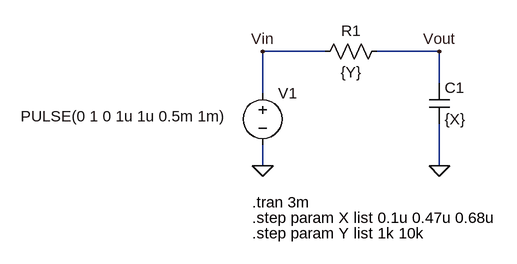
[diagram p0: schematic Parameter_Sweeps_RC_Response.asc]
Parameter_Sweeps_RC_Response.asc, the LTspice schematic file:
Version 4
SHEET 1 880 680
WIRE 144 128 48 128
WIRE 320 128 224 128
WIRE 320 176 320 128
WIRE 48 192 48 128
WIRE 48 304 48 272
WIRE 320 304 320 240
FLAG 48 304 0
FLAG 320 304 0
FLAG 48 128 Vin
FLAG 320 128 Vout
SYMBOL res 240 112 R90
WINDOW 0 0 56 VBottom 2
WINDOW 3 32 56 VTop 2
SYMATTR InstName R1
SYMATTR Value {Y}
SYMBOL voltage 48 176 R0
WINDOW 3 -372 52 Left 2
WINDOW 123 0 0 Left 0
WINDOW 39 0 0 Left 0
SYMATTR InstName V1
SYMATTR Value PULSE(0 1 0 1u 1u 0.5m 1m)
SYMBOL cap 304 176 R0
SYMATTR InstName C1
SYMATTR Value {X}
TEXT 32 360 Left 2 !.tran 3m
TEXT 32 384 Left 2 !.step param X list 0.1u 0.47u 0.68u
TEXT 32 408 Left 2 !.step param Y list 1k 10k

The netlist it stands for:
* Parameter_Sweeps_RC_Response.asc
R1 Vout Vin {Y}
V1 Vin 0 PULSE(0 1 0 1u 1u 0.5m 1m)
C1 Vout 0 {X}
.tran 3m
.step param X list 0.1u 0.47u 0.68u
.step param Y list 1k 10k
.backanno
.end

* Results of the author's LTspice run, read from the files saved beside the schematic
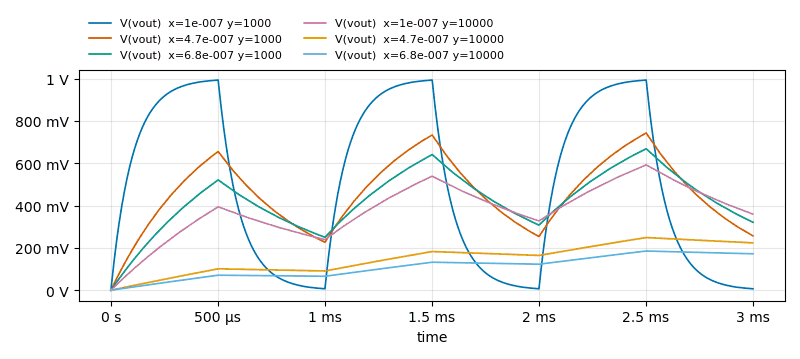
[diagram p1: Transient Analysis of Parameter_Sweeps_RC_Response.asc, plotted from the saved traces]
* Transient Analysis, 6 runs:
*   V(vout) [x=1e-007 y=1000]: min 0 V, max 993.3 mV, average 500.8 mV, rms 634.3 mV, last 6.792 mV
*   V(vout) [x=4.7e-007 y=1000]: min 0 V, max 742.7 mV, average 460.8 mV, rms 487.5 mV, last 257.2 mV
*   V(vout) [x=6.8e-007 y=1000]: min 0 V, max 668.4 mV, average 428.2 mV, rms 448.8 mV, last 321.2 mV
*   V(vout) [x=1e-007 y=10000]: min 0 V, max 592.2 mV, average 381.1 mV, rms 400.4 mV, last 359.8 mV
*   V(vout) [x=4.7e-007 y=10000]: min 0 V, max 248.9 mV, average 150.2 mV, rms 164.7 mV, last 223.9 mV
*   V(vout) [x=6.8e-007 y=10000]: min 0 V, max 185.3 mV, average 110.7 mV, rms 122.3 mV, last 172.2 mV